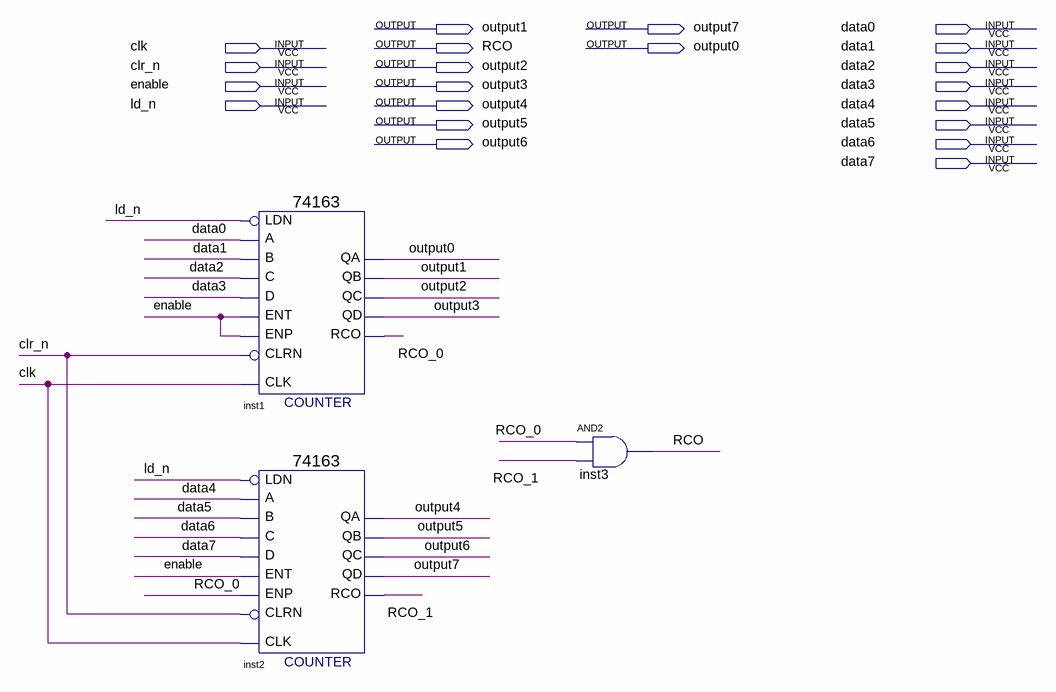
[diagram p0: schematic sheet]
// Quartus schematic RippleCounter.bdf as structural Verilog: 3 symbols, 21 pins
module RippleCounter (
  input  data0,
  input  clk,
  input  data1,
  input  clr_n,
  input  data2,
  input  enable,
  input  data3,
  input  ld_n,
  input  data4,
  input  data5,
  input  data6,
  input  data7,
  output output1,
  output output7,
  output RCO,
  output output0,
  output output2,
  output output3,
  output output4,
  output output5,
  output output6
);

  wire RCO_0, RCO_1;

  \74163  inst1 (
    .C(data2), .B(data1), .A(data0), .ENT(enable), .D(data3), .CLRN(clr_n), .CLK(clk), .ENP(enable),
    .LDN(ld_n), .QA(output0), .QB(output1), .QC(output2), .QD(output3), .RCO(RCO_0));
  \74163  inst2 (
    .C(data6), .B(data5), .A(data4), .ENT(enable), .D(data7), .CLRN(clr_n), .CLK(clk), .ENP(RCO_0),
    .LDN(ld_n), .QA(output4), .QB(output5), .QC(output6), .QD(output7), .RCO(RCO_1));
  and inst3 (RCO, RCO_0, RCO_1);
endmodule
